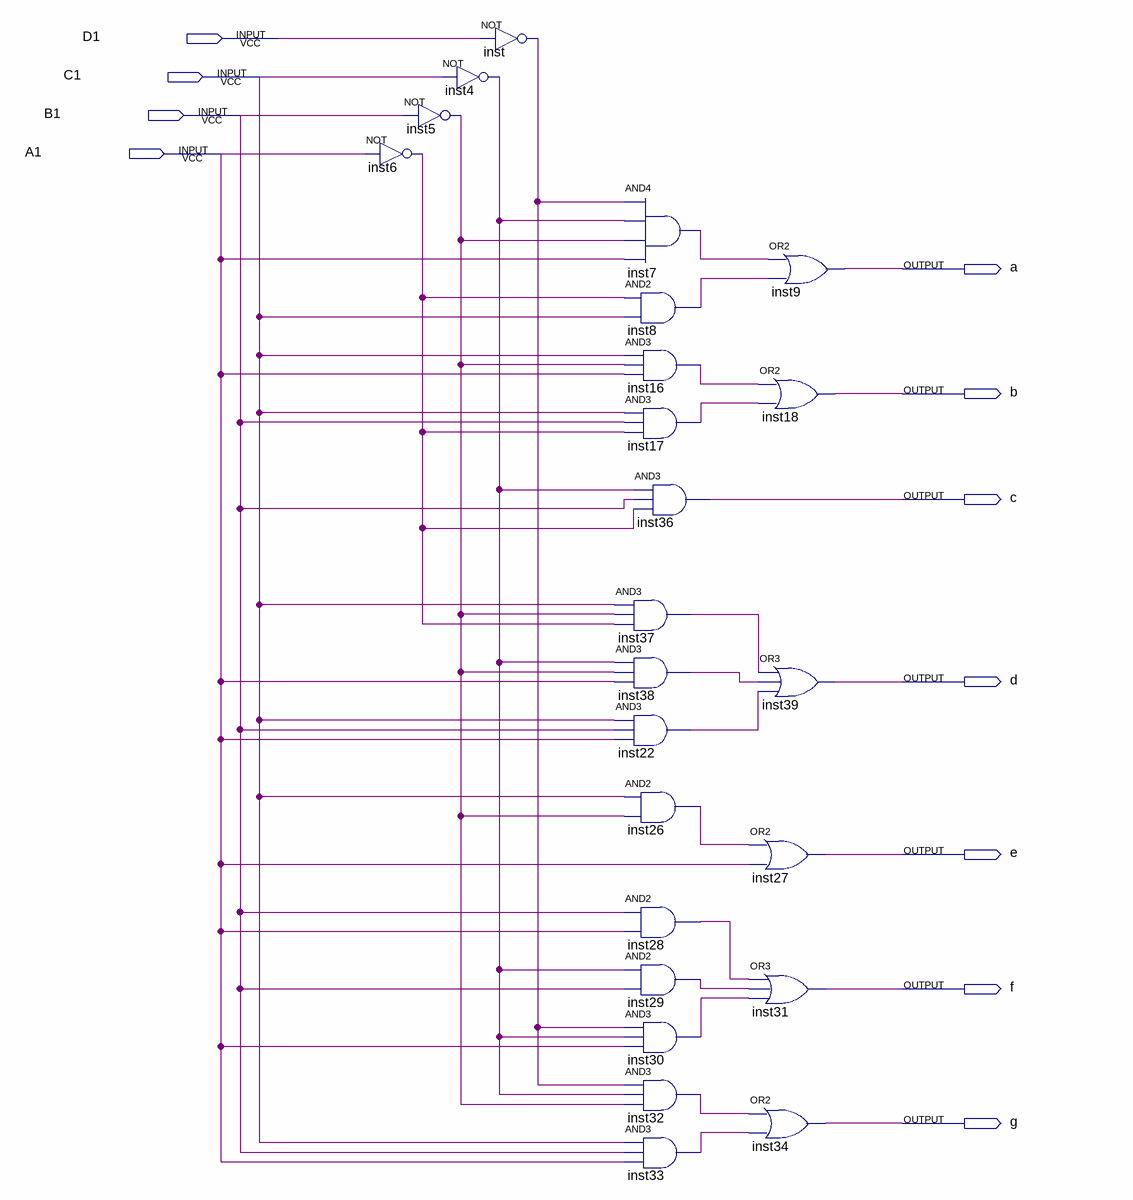
[diagram p0: schematic sheet]
// Quartus schematic BCD7SEGMENTEANOD.bdf as structural Verilog: 24 symbols, 11 pins
module BCD7SEGMENTEANOD (
  input  D1,
  input  C1,
  input  B1,
  input  A1,
  output a,
  output b,
  output c,
  output d,
  output e,
  output f,
  output g
);

  wire inst4_out, inst5_out, inst6_out, inst7_out, inst8_out, inst16_out, inst17_out, inst22_out, inst26_out,
       inst28_out, inst29_out, inst30_out, inst32_out, inst33_out, inst37_out, inst38_out, inst_out;

  not inst5 (inst5_out, B1);
  not inst6 (inst6_out, A1);
  not inst (inst_out, D1);
  not inst4 (inst4_out, C1);
  and inst7 (inst7_out, inst_out, inst4_out, inst5_out, A1);
  and inst8 (inst8_out, inst6_out, C1);
  and inst16 (inst16_out, C1, inst5_out, A1);
  and inst17 (inst17_out, C1, B1, inst6_out);
  and inst36 (c, inst4_out, B1, inst6_out);
  and inst37 (inst37_out, C1, inst5_out, inst6_out);
  and inst38 (inst38_out, inst4_out, inst5_out, A1);
  and inst22 (inst22_out, C1, B1, A1);
  and inst26 (inst26_out, C1, inst5_out);
  and inst28 (inst28_out, B1, A1);
  and inst29 (inst29_out, inst4_out, B1);
  and inst30 (inst30_out, inst_out, inst4_out, A1);
  and inst32 (inst32_out, inst_out, inst4_out, inst5_out);
  and inst33 (inst33_out, C1, B1, A1);
  or inst9 (a, inst7_out, inst8_out);
  or inst18 (b, inst16_out, inst17_out);
  or inst39 (d, inst37_out, inst38_out, inst22_out);
  or inst27 (e, inst26_out, A1);
  or inst31 (f, inst28_out, inst29_out, inst30_out);
  or inst34 (g, inst32_out, inst33_out);
endmodule
